# Altium schematic sheet CTR-Charging-Base-Rev-B-Power.SchDoc: ZoZbot Charging Base Board
size B; Author: RMG; Organization: OLogic, Inc.; DocumentNumber: 112216; Revision: B; SheetNumber: 1; SheetTotal: 1; PageSetup: Record=PageOptions|CenterHorizontal=True|CenterVertical=True|PrintScale=0.70|XCorrection=1.00|YCorrection=1.00|PrintKind=0|BorderSize=5000000|LeftOffset=0|BottomOffset=0|Orientation=2|PaperLength=1000|PaperWidth=1000|Scale=100|PaperSource=15|PrintQuality=600|MediaType=1|DitherType=10|PrintScaleMode=1|PaperKind=Letter|PaperIndex=1
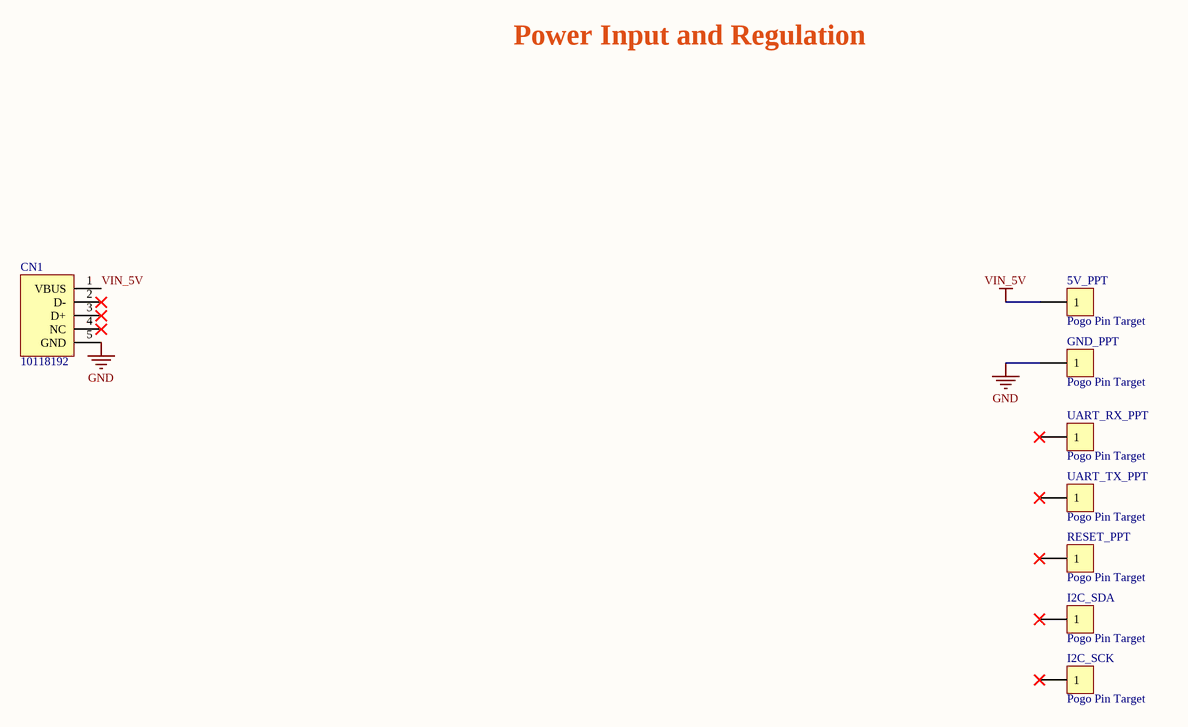
[diagram p0: CTR-Charging-Base-Rev-B-Power.SchDoc]

## Parts
5V_PPT  Pogo Pin Target  [POGO_PIN]
CN1  10118192  [USB-MICRO-B]
GND_PPT  Pogo Pin Target  [POGO_PIN]
I2C_SCK  Pogo Pin Target  [POGO_PIN]
I2C_SDA  Pogo Pin Target  [POGO_PIN]
RESET_PPT  Pogo Pin Target  [POGO_PIN]
UART_RX_PPT  Pogo Pin Target  [POGO_PIN]
UART_TX_PPT  Pogo Pin Target  [POGO_PIN]

## Nets
GND: CN1.5(GND) GND_PPT.1
VIN_5V: 5V_PPT.1 CN1.1(VBUS)

Not connected (* = marked no-connect by the designer): CN1 2(D-)* 3(D+)* 4(NC)*; I2C_SCK 1*; I2C_SDA 1*; RESET_PPT 1*; UART_RX_PPT 1*; UART_TX_PPT 1*

## Notes on the sheet
- Power Input and Regulation
- Title
- By:
- Date:
- Number:
- Time:
- Revision:
- Sheet
- of
- OLogic, Inc.
- 1394 Borregas Ave.
- Sunnyvale, CA
- 94089 USA
- File:
- (650) 996-1490

## Library data of the parts
5V_PPT GND_PPT I2C_SCK I2C_SDA RESET_PPT UART_RX_PPT UART_TX_PPT = 0850-0-15-20-83-14-11-0: Manufacturer: Mill-Max Manufacturing Corp.; Manufacturer Part Number: 1949-0-00-15-00-00-03-0; Plating: Gold; Plating - Thickness: 20µin (0.51µm); RoHS: RoHS Compliant; Category: Connectors, Interconnects; Part Status: Active; Material: Copper Alloy; Mounting Type: Through Hole; ComponentLink1URL: http://www.mill-max.com/assets/pdfs/028.pdf; ComponentLink1Description: http://www.mill-max.com/assets/pdfs/028.pdf
CN1 = Micro-USB-B: Micro-USB RA Type B; Manufacturer 1: FCI; Manufacturer Part Number 1: 10118192-0001LF; Supplier Part Number 1: 609-4613-1-ND; Supplier 1: Digi-Key